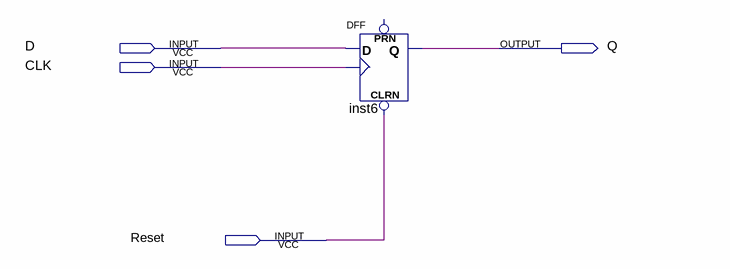
[diagram p0: schematic sheet]
// Quartus schematic work1.bdf as structural Verilog: 1 symbols, 4 pins
module work1 (
  input  D,
  input  CLK,
  input  Reset,
  output Q
);

  DFF inst6 (.CLRN(Reset), .CLK(CLK), .D(D), .Q(Q));  // open: PRN
endmodule
